# Altium schematic sheet LB-word-powerOR.SchDoc
size A4
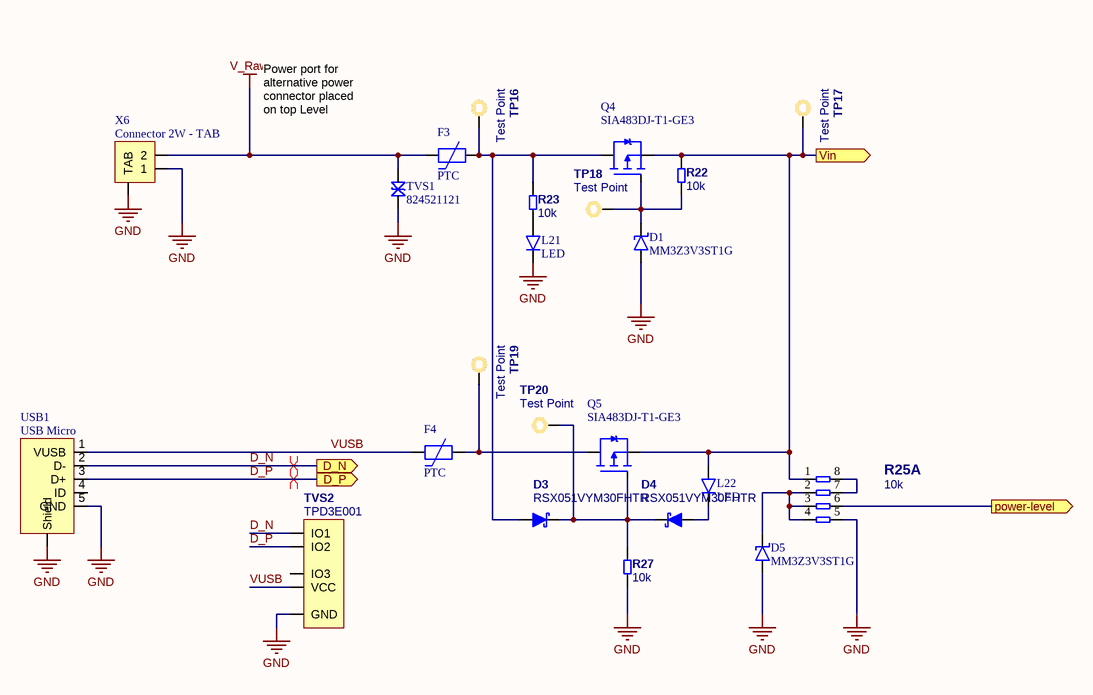
[diagram p0: LB-word-powerOR.SchDoc]

## Parts
D1  MM3Z3V3ST1G  [SOD323F-Comchip Variant]
D3  RSX051VYM30FHTR  [SOD323F]
D4  RSX051VYM30FHTR  [SOD323F]
D5  MM3Z3V3ST1G  [SOD323F-Comchip Variant]
F3  PTC  [1812]
F4  PTC  [1812]
L21  LED  [LED 0603/1608]
L22  LED  [LED 0603/1608]
Q4  SIA483DJ-T1-GE3  [SC70-6L]
Q5  SIA483DJ-T1-GE3  [SC70-6L]
R22  10k  [R0603]
R23  10k  [R0603]
R25  value 10k  [YC164]  (parts A,B,C,D of 4)
R27  10k  [R0603]
TP16  Test Point  [TestPoint-1.2mm]
TP17  Test Point  [TestPoint-1.2mm]
TP18  Test Point  [TestPoint-1.2mm]
TP19  Test Point  [TestPoint-1.2mm]
TP20  Test Point  [TestPoint-1.2mm]
TVS1  824521121  [DO214AC SMA]
TVS2  TPD3E001  [SOT23-5_N]
USB1  USB Micro  [USB Micro]
X6  Connector 2W - TAB  [PTSM-2W-H-SMD]

## Ports
D_N (out), D_P (out), power-level (out), Vin (out)

## Nets
GND: D1.1 D5.A L21.1(K) R25.5 R27.1 TVS1.2 TVS2.3(GND) USB1.5(GND) USB1.Shield X6.1 X6.TAB
V_Raw: F3.1 TVS1.1 X6.2
D_N: TVS2.1(IO1) USB1.2(D-) ; port D_N
D_P: TVS2.2(IO2) USB1.3(D+) ; port D_P
power-level: R25.6 ; port power-level
Vin: L22.2(A) Q4.S Q5.S R22.2 R25.1 TP17.1 ; port Vin
VUSB: F4.1 TVS2.5(VCC) USB1.1(VUSB)
NetD1_2: D1.2 Q4.G R22.1 TP18.1
NetD3_A: D3.A F3.2 Q4.D R23.2 TP16.1
NetD3_K: D3.K D4.K Q5.G R27.2 TP20.1
NetD4_A: D4.A L22.1(K)
NetD5_K: D5.K R25.2 R25.3 R25.4
NetF4_2: F4.2 Q5.D TP19.1
NetL21_2: L21.2(A) R23.1
NetR25_7: R25.7 R25.8

Not connected (* = marked no-connect by the designer): TVS2 4(IO3); USB1 4(ID)

## Layout directives
differential pair: D_N, D_P

## Notes on the sheet
- Power port for alternative power connector placed on top Level sheet

## Library data of the parts
D1 D5 = TVS
D3 D4 = Diode Schottky
F3 F4 = PTC: PTC, Resettable Fuse
Q4 Q5 = MOSFET P CH
R22 R23 R27 = Resistor: Published: 17-Dec-2003; LatestRevisionDate: 19-Mar-2004; LatestRevisionNote: Silkscreen size reduced.; PackageDocument: Mar-2003; PackageReference: 3-0603; Publisher: Altium Limited; Code_IPC: 1608 [0603]; ComponentLink1Description: Manufacturer Link; ComponentLink1URL: http://www.panasonic.com/industrial/components/resistive_products.htm; ComponentLink2Description: Datasheet; ComponentLink2URL: http://www.panasonic.com/industrial/components/pdf/AOA0000CE2.pdf; Value: 10k
R25 = Resistor Array - 4P
TVS1 = TVS Bidirectional